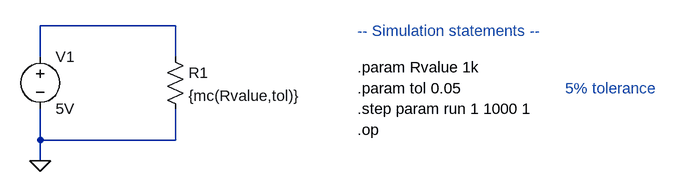
[diagram p0: schematic MonteCarloExample.asc]
MonteCarloExample.asc, the LTspice schematic file:
Version 4
SHEET 1 1164 680
WIRE 304 48 96 48
WIRE 96 96 96 48
WIRE 304 96 304 48
WIRE 96 224 96 176
WIRE 304 224 304 176
WIRE 304 224 96 224
WIRE 96 256 96 224
FLAG 96 256 0
SYMBOL voltage 96 80 R0
WINDOW 123 0 0 Left 2
WINDOW 39 0 0 Left 2
SYMATTR InstName V1
SYMATTR Value 5V
SYMBOL res 288 80 R0
SYMATTR InstName R1
SYMATTR Value {mc(Rvalue,tol)}
TEXT 584 112 Left 2 !.param Rvalue 1k
TEXT 584 144 Left 2 !.param tol 0.05
TEXT 584 176 Left 2 !.step param run 1 1000 1
TEXT 584 56 Left 2 ;-- Simulation statements --
TEXT 584 208 Left 2 !.op
TEXT 904 144 Left 2 ;5% tolerance

The netlist it stands for:
* MonteCarloExample.asc
V1 N001 0 5V
R1 N001 0 {mc(Rvalue,tol)}
.param Rvalue 1k
.param tol 0.05
.step param run 1 1000 1
* -- Simulation statements --
.op
* 5% tolerance
.backanno
.end